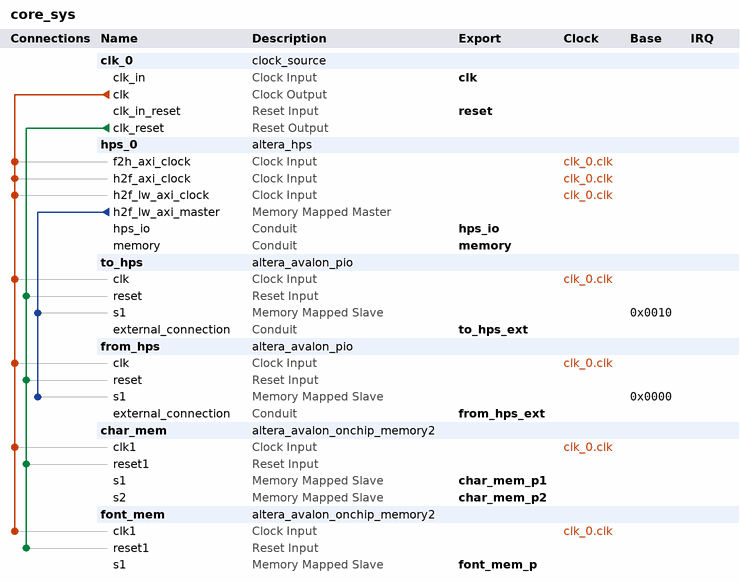
[diagram p0: system contents]
# Platform Designer (Qsys) system core_sys, Cyclone V 5CSEMA5F31C6
# Parameters at their usual value, and those the tool derives, are not listed.
package require -exact qsys 21.1
create_system core_sys
set_project_property DEVICE_FAMILY {Cyclone V}
set_project_property DEVICE 5CSEMA5F31C6

add_instance clk_0 clock_source 21.1
set_instance_parameter_value clk_0 clockFrequency 50000000

add_instance hps_0 altera_hps 21.1
set_instance_parameter_value hps_0 EMAC1_Mode RGMII
set_instance_parameter_value hps_0 EMAC1_PinMuxing {HPS I/O Set 0}
set_instance_parameter_value hps_0 F2SCLK_COLDRST_Enable false
set_instance_parameter_value hps_0 F2SCLK_DBGRST_Enable false
set_instance_parameter_value hps_0 F2SCLK_WARMRST_Enable false
set_instance_parameter_value hps_0 F2SINTERRUPT_Enable false
set_instance_parameter_value hps_0 F2S_Width 2
set_instance_parameter_value hps_0 FPGA_PERIPHERAL_OUTPUT_CLOCK_FREQ_EMAC0_GTX_CLK 125
set_instance_parameter_value hps_0 FPGA_PERIPHERAL_OUTPUT_CLOCK_FREQ_EMAC0_MD_CLK 2.5
set_instance_parameter_value hps_0 FPGA_PERIPHERAL_OUTPUT_CLOCK_FREQ_EMAC1_GTX_CLK 125
set_instance_parameter_value hps_0 FPGA_PERIPHERAL_OUTPUT_CLOCK_FREQ_EMAC1_MD_CLK 2.5
set_instance_parameter_value hps_0 HPS_PROTOCOL DDR3
set_instance_parameter_value hps_0 I2C0_Mode N/A
set_instance_parameter_value hps_0 I2C0_PinMuxing Unused
set_instance_parameter_value hps_0 I2C1_Mode N/A
set_instance_parameter_value hps_0 I2C1_PinMuxing Unused
set_instance_parameter_value hps_0 LWH2F_Enable true
set_instance_parameter_value hps_0 MEM_BANKADDR_WIDTH 3
set_instance_parameter_value hps_0 MEM_CLK_FREQ 400.0
set_instance_parameter_value hps_0 MEM_COL_ADDR_WIDTH 10
set_instance_parameter_value hps_0 MEM_DQ_WIDTH 32
set_instance_parameter_value hps_0 MEM_DRV_STR RZQ/6
set_instance_parameter_value hps_0 MEM_ROW_ADDR_WIDTH 15
set_instance_parameter_value hps_0 MEM_RTT_NOM RZQ/4
set_instance_parameter_value hps_0 MEM_RTT_WR {Dynamic ODT off}
set_instance_parameter_value hps_0 MEM_TCL 11
set_instance_parameter_value hps_0 MEM_TFAW_NS 30.0
set_instance_parameter_value hps_0 MEM_TRAS_NS 35.0
set_instance_parameter_value hps_0 MEM_TRCD_NS 13.75
set_instance_parameter_value hps_0 MEM_TRFC_NS 260.0
set_instance_parameter_value hps_0 MEM_TRP_NS 13.75
set_instance_parameter_value hps_0 MEM_VENDOR JEDEC
set_instance_parameter_value hps_0 MEM_WTCL 8
set_instance_parameter_value hps_0 QSPI_Mode N/A
set_instance_parameter_value hps_0 QSPI_PinMuxing Unused
set_instance_parameter_value hps_0 REF_CLK_FREQ 25.0
set_instance_parameter_value hps_0 S2FCLK_USER2CLK 5
set_instance_parameter_value hps_0 S2F_Width 2
set_instance_parameter_value hps_0 SDIO_Mode {4-bit Data}
set_instance_parameter_value hps_0 SDIO_PinMuxing {HPS I/O Set 0}
set_instance_parameter_value hps_0 SPIM1_Mode N/A
set_instance_parameter_value hps_0 SPIM1_PinMuxing Unused
set_instance_parameter_value hps_0 STM_Enable false
set_instance_parameter_value hps_0 TIMING_BOARD_AC_SKEW 0.03
set_instance_parameter_value hps_0 TIMING_BOARD_AC_TO_CK_SKEW 0.0
set_instance_parameter_value hps_0 TIMING_BOARD_DQ_TO_DQS_SKEW 0.0
set_instance_parameter_value hps_0 TIMING_BOARD_MAX_CK_DELAY 0.03
set_instance_parameter_value hps_0 TIMING_BOARD_MAX_DQS_DELAY 0.02
set_instance_parameter_value hps_0 TIMING_BOARD_SKEW_BETWEEN_DQS 0.08
set_instance_parameter_value hps_0 TIMING_BOARD_SKEW_CKDQS_DIMM_MAX 0.16
set_instance_parameter_value hps_0 TIMING_BOARD_SKEW_CKDQS_DIMM_MIN 0.09
set_instance_parameter_value hps_0 TIMING_BOARD_SKEW_WITHIN_DQS 0.01
set_instance_parameter_value hps_0 TIMING_TDH 65
set_instance_parameter_value hps_0 TIMING_TDQSCK 255
set_instance_parameter_value hps_0 TIMING_TDQSQ 125
set_instance_parameter_value hps_0 TIMING_TDS 30
set_instance_parameter_value hps_0 TIMING_TIH 140
set_instance_parameter_value hps_0 TIMING_TIS 180
set_instance_parameter_value hps_0 TIMING_TQSH 0.4
set_instance_parameter_value hps_0 UART0_Mode {No Flow Control}
set_instance_parameter_value hps_0 UART0_PinMuxing {HPS I/O Set 0}
set_instance_parameter_value hps_0 USB1_Mode SDR
set_instance_parameter_value hps_0 USB1_PinMuxing {HPS I/O Set 0}
set_instance_parameter_value hps_0 desired_cfg_clk_mhz 100.0
set_instance_parameter_value hps_0 desired_qspi_clk_mhz 400.0

add_instance to_hps altera_avalon_pio 21.1
set_instance_parameter_value to_hps direction Input
set_instance_parameter_value to_hps width 32

add_instance from_hps altera_avalon_pio 21.1
set_instance_parameter_value from_hps direction Output
set_instance_parameter_value from_hps width 32

add_instance char_mem altera_avalon_onchip_memory2 21.1
set_instance_parameter_value char_mem dataWidth 8
set_instance_parameter_value char_mem dualPort true
set_instance_parameter_value char_mem initMemContent false
set_instance_parameter_value char_mem initializationFileName onchip_mem.hex
set_instance_parameter_value char_mem memorySize 8192
set_instance_parameter_value char_mem readDuringWriteMode OLD_DATA
set_instance_parameter_value char_mem resetrequest_enabled false
set_instance_parameter_value char_mem singleClockOperation true

add_instance font_mem altera_avalon_onchip_memory2 21.1
set_instance_parameter_value font_mem dataWidth 512
set_instance_parameter_value font_mem dualPort false
set_instance_parameter_value font_mem initMemContent true
set_instance_parameter_value font_mem initializationFileName /home/felucco/Documents/Universita/EdSE/Quartus_Proj/HPS_Text_Renderer/font_mem.hex
set_instance_parameter_value font_mem memorySize 6080
set_instance_parameter_value font_mem resetrequest_enabled false
set_instance_parameter_value font_mem useNonDefaultInitFile true
set_instance_parameter_value font_mem writable false

# connections
add_connection clk_0.clk char_mem.clk1 clock
add_connection clk_0.clk font_mem.clk1 clock
add_connection clk_0.clk from_hps.clk clock
add_connection clk_0.clk hps_0.f2h_axi_clock clock
add_connection clk_0.clk hps_0.h2f_axi_clock clock
add_connection clk_0.clk hps_0.h2f_lw_axi_clock clock
add_connection clk_0.clk to_hps.clk clock
add_connection clk_0.clk_reset char_mem.reset1 reset
add_connection clk_0.clk_reset font_mem.reset1 reset
add_connection clk_0.clk_reset from_hps.reset reset
add_connection clk_0.clk_reset to_hps.reset reset
add_connection hps_0.h2f_lw_axi_master from_hps.s1 avalon
set_connection_parameter_value hps_0.h2f_lw_axi_master/from_hps.s1 baseAddress 0x0000
add_connection hps_0.h2f_lw_axi_master to_hps.s1 avalon
set_connection_parameter_value hps_0.h2f_lw_axi_master/to_hps.s1 baseAddress 0x0010

# exported interfaces
add_interface char_mem_p1 avalon slave
set_interface_property char_mem_p1 EXPORT_OF char_mem.s1
add_interface char_mem_p2 avalon slave
set_interface_property char_mem_p2 EXPORT_OF char_mem.s2
add_interface clk clock sink
set_interface_property clk EXPORT_OF clk_0.clk_in
add_interface font_mem_p avalon slave
set_interface_property font_mem_p EXPORT_OF font_mem.s1
add_interface from_hps_ext conduit end
set_interface_property from_hps_ext EXPORT_OF from_hps.external_connection
add_interface hps_io conduit end
set_interface_property hps_io EXPORT_OF hps_0.hps_io
add_interface memory conduit end
set_interface_property memory EXPORT_OF hps_0.memory
add_interface reset reset sink
set_interface_property reset EXPORT_OF clk_0.clk_in_reset
add_interface to_hps_ext conduit end
set_interface_property to_hps_ext EXPORT_OF to_hps.external_connection

set_interconnect_requirement {$system} qsys_mm.clockCrossingAdapter HANDSHAKE
set_interconnect_requirement {$system} qsys_mm.enableEccProtection FALSE
set_interconnect_requirement {$system} qsys_mm.insertDefaultSlave FALSE
set_interconnect_requirement {$system} qsys_mm.maxAdditionalLatency 1

save_system core_sys.qsys
